# Altium schematic sheet LED Driver.SchDoc
size A4
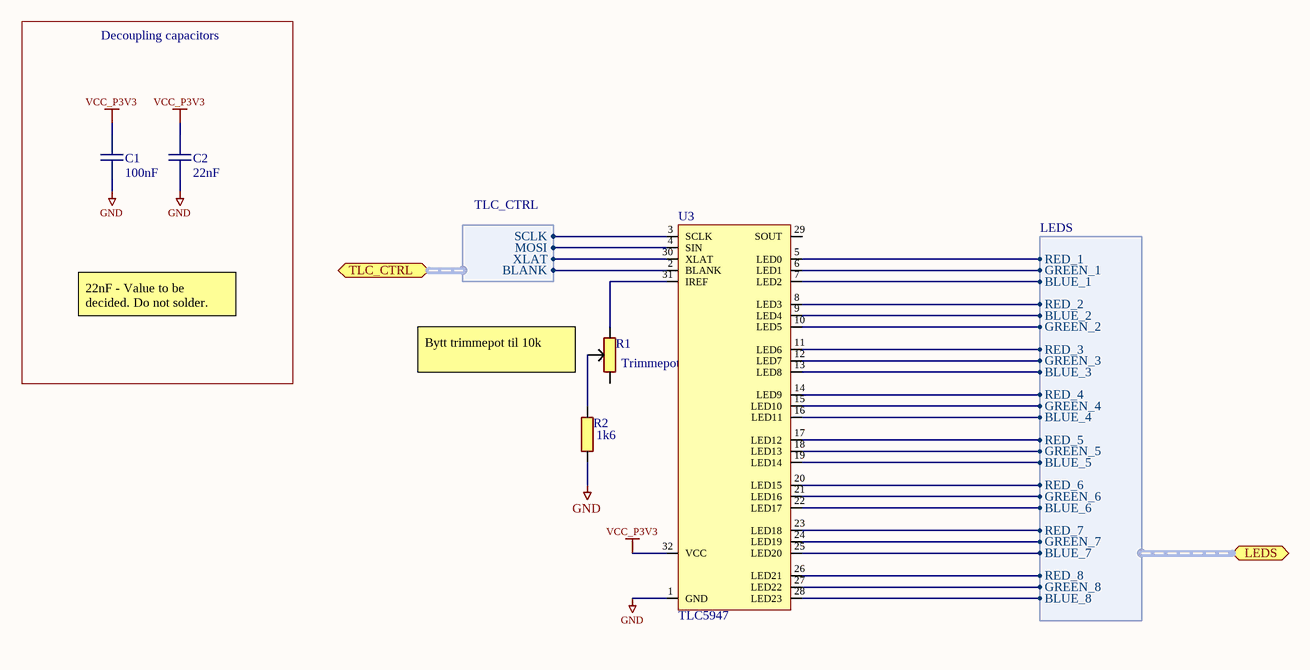
[diagram p0: LED Driver.SchDoc]

## Parts
C1  100nF  [CAPC0603(1608)55_N]
C2  22nF  [CAPC0805(2012)100_N]
R1  Trimmepot 500ohm  [TRIMPOT_3006P]
R2  1k6  [RESC0603(1608)_N]
U3  TLC5947

## Blocks framed on the sheet
Decoupling capacitors: C1 C2

## Ports
LEDS (harness LEDS), TLC_CTRL (harness TLC_CTRL)

## Harnesses
TLC_CTRL: SCLK, MOSI, XLAT, BLANK
LEDS: BLUE_1, BLUE_2, BLUE_3, BLUE_4, BLUE_5, BLUE_6, BLUE_7, GREEN_1, GREEN_2, GREEN_3, GREEN_4, GREEN_5, GREEN_6, GREEN_7, GREEN_8, RED_1, RED_2, RED_3, RED_4, RED_5, RED_6, RED_7, RED_8, BLUE_8

## Nets
GND: C1.1 C2.1 R2.1 U3.1(GND)
VCC_P3V3: C1.2 C2.2 U3.32(VCC)
NetR1_2: R1.2 R2.2
NetR1_3: R1.3 U3.31(IREF)
NetU3_2: U3.2(BLANK) ; port TLC_CTRL.BLANK
NetU3_3: U3.3(SCLK) ; port TLC_CTRL.SCLK
NetU3_4: U3.4(SIN) ; port TLC_CTRL.MOSI
NetU3_5: U3.5(LED0) ; port LEDS.RED_1
NetU3_6: U3.6(LED1) ; port LEDS.GREEN_1
NetU3_7: U3.7(LED2) ; port LEDS.BLUE_1
NetU3_8: U3.8(LED3) ; port LEDS.RED_2
NetU3_9: U3.9(LED4) ; port LEDS.BLUE_2
NetU3_10: U3.10(LED5) ; port LEDS.GREEN_2
NetU3_11: U3.11(LED6) ; port LEDS.RED_3
NetU3_12: U3.12(LED7) ; port LEDS.GREEN_3
NetU3_13: U3.13(LED8) ; port LEDS.BLUE_3
NetU3_14: U3.14(LED9) ; port LEDS.RED_4
NetU3_15: U3.15(LED10) ; port LEDS.GREEN_4
NetU3_16: U3.16(LED11) ; port LEDS.BLUE_4
NetU3_17: U3.17(LED12) ; port LEDS.RED_5
NetU3_18: U3.18(LED13) ; port LEDS.GREEN_5
NetU3_19: U3.19(LED14) ; port LEDS.BLUE_5
NetU3_20: U3.20(LED15) ; port LEDS.RED_6
NetU3_21: U3.21(LED16) ; port LEDS.GREEN_6
NetU3_22: U3.22(LED17) ; port LEDS.BLUE_6
NetU3_23: U3.23(LED18) ; port LEDS.RED_7
NetU3_24: U3.24(LED19) ; port LEDS.GREEN_7
NetU3_25: U3.25(LED20) ; port LEDS.BLUE_7
NetU3_26: U3.26(LED21) ; port LEDS.RED_8
NetU3_27: U3.27(LED22) ; port LEDS.GREEN_8
NetU3_28: U3.28(LED23) ; port LEDS.BLUE_8
NetU3_30: U3.30(XLAT) ; port TLC_CTRL.XLAT

Not connected (* = marked no-connect by the designer): R1 1; U3 29(SOUT)

## Notes on the sheet
- 22nF - Value to be decided. Do not solder.
- Bytt trimmepot til 10k
- Size:
- Date:
- Title:
- A3
- Revision:
- Sheet
- of
- Author:
- File:

## Library data of the parts
C1 = 3028: X7R 50V 5%; id: 3028; pakke_opprettet_av: 815; leverandor_varenr: 1759122; pris: 1; nokkelord: Kondensator, Capacitor, CAP; produsent: Multikomp; leverandor: Farnell; pakketype: 0603; pakke_opprettet: 18-Feb-15 2:18:13 PM; symbol_opprettet_av: 815; symbol_opprettet: 14-Nov-14 8:19:34 PM; navn: 100nF
C2 = 2446: X7R 50V; id: 2446; pakke_opprettet_av: 815; leverandor_varenr: 2627092; pris: 1; nokkelord: Capacitor Cap Kondis; produsent: Multicomp; leverandor: Farnell; pakketype: 0805; pakke_opprettet: 11/14/2014 8:52:01 PM; symbol_opprettet_av: 815; symbol_opprettet: 11/14/2014 8:19:34 PM; navn: 22nF
R1 = 1365: 15 turn, horizontal; id: 1365; rad: 1; rom: OV; lager_type: Fremlager; dybde: 2; hylle: 7; antall: 50; pakke_opprettet_av: 815; leverandor_varenr: 9352376; pris: 15; nokkelord: trimpot; produsent: Bourns; leverandor: Farnell; pakketype: TH; kolonne: 1; pakke_opprettet: 2/10/2017 3:29:47 PM; symbol_opprettet_av: 815; symbol_opprettet: 11/3/2016 3:34:07 PM; navn: Trimmepot 500ohm
R2 = 3446: 0.1W 1% Thick film resistor; id: 3446; rad: -1; rom: OV; lager_type: Fremlager; dybde: 53; hylle: 6; antall: 100; kolonne: 0; pakke_opprettet_av: 815; pakketype: 0603; pakke_opprettet: 7/8/2014 9:15:30 PM; symbol_opprettet_av: 815; symbol_opprettet: 7/8/2014 9:16:33 PM; navn: 1k6; pris: 0